# Altium schematic sheet MCU.SchDoc
size A4
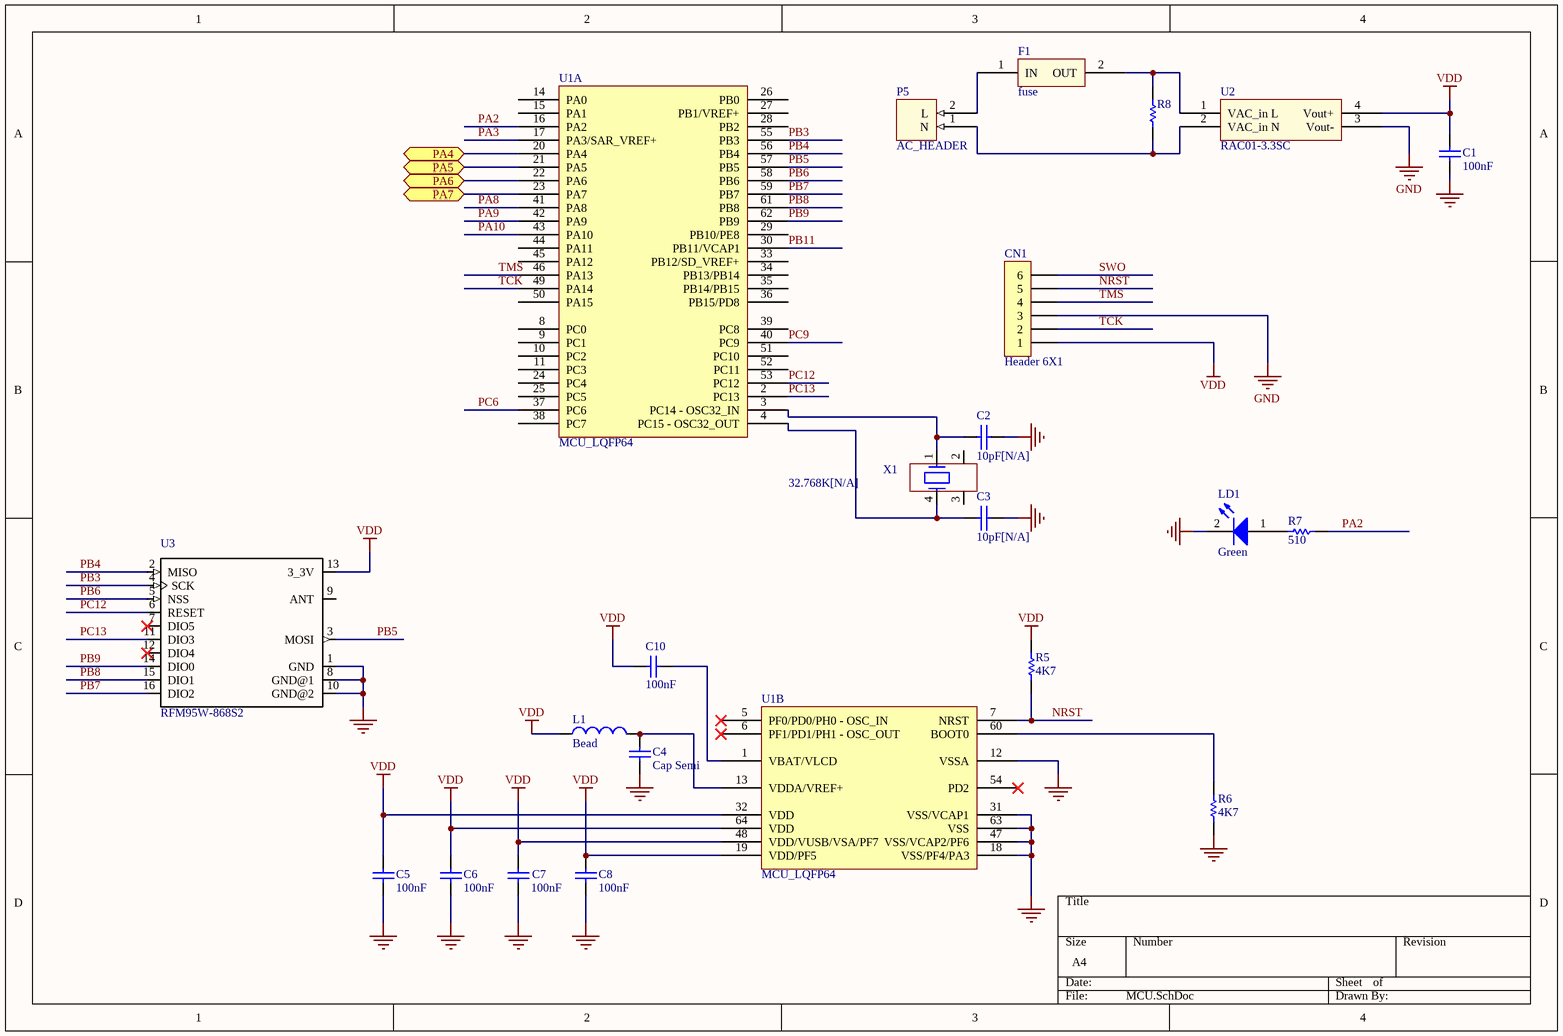
[diagram p0: MCU.SchDoc]

## Parts
C1  100nF  [0603C]
C2  10pF[N/A]  [0603C]
C3  10pF[N/A]  [0603C]
C4  Cap Semi  [1608[0603]]
C5  100nF  [0603C]
C6  100nF  [0603C]
C7  100nF  [0603C]
C8  100nF  [0603C]
C10  100nF  [0603C]
CN1  Header 6X1  [1*6P]
F1  fuse  [fuse]
L1  Bead  [INDC1608L]
LD1  Green  [0603D]
P5  AC_HEADER  [ac_header_2]
R5  4K7  [0603R]
R6  4K7  [0603R]
R7  510  [0603R]
R8  (no value)  [varistor]
U1  MCU_LQFP64  [LQFP64]  (parts A,B of 2)
U2  RAC01-3.3SC  [RAC01-3.3SC]
U3  RFM95W-868S2  [XCVR_RFM95W-868S2]
X1  32.768K[N/A]  [XTAL_4SM_8X3R8]

## Ports
PA4, PA5, PA6, PA7

## Nets
GND: C1.2 C2.2 C3.2 C4.2 C5.2 C6.2 C7.2 C8.2 CN1.3 LD1.2(K) R6.1 U1.12(VSSA) U1.18(VSS/PF4/PA3) U1.31(VSS/VCAP1) U1.47(VSS/VCAP2/PF6) U1.63(VSS) U2.3(Vout-) U3.1(GND) U3.8(GND@1) U3.10(GND@2)
VDD: C1.1 C5.1 C6.1 C7.1 C8.1 C10.1 CN1.1 L1.1 R5.2 U1.19(VDD/PF5) U1.32(VDD) U1.48(VDD/VUSB/VSA/PF7) U1.64(VDD) U2.4(Vout+) U3.13(3_3V)
NRST: CN1.5 R5.1 U1.7(NRST)
PA2: R7.1 U1.16(PA2)
PA3: U1.17(PA3/SAR_VREF+)
PA4: U1.20(PA4) ; port PA4
PA5: U1.21(PA5) ; port PA5
PA6: U1.22(PA6) ; port PA6
PA7: U1.23(PA7) ; port PA7
PA8: U1.41(PA8)
PA9: U1.42(PA9)
PA10: U1.43(PA10)
PB3: U1.55(PB3) U3.4(SCK)
PB4: U1.56(PB4) U3.2(MISO)
PB5: U1.57(PB5) U3.3(MOSI)
PB6: U1.58(PB6) U3.5(NSS)
PB7: U1.59(PB7) U3.16(DIO2)
PB8: U1.61(PB8) U3.15(DIO1)
PB9: U1.62(PB9) U3.14(DIO0)
PB11: U1.30(PB11/VCAP1)
PC6: U1.37(PC6)
PC9: U1.40(PC9)
PC12: U1.53(PC12) U3.6(RESET)
PC13: U1.2(PC13) U3.11(DIO3)
SWO: CN1.6
TCK: CN1.2 U1.49(PA14)
TMS: CN1.4 U1.46(PA13)
NetC2_1: C2.1 U1.3(PC14_-_OSC32_IN) X1.1
NetC3_1: C3.1 U1.4(PC15_-_OSC32_OUT) X1.4
NetC4_1: C4.1 L1.2 U1.13(VDDA/VREF+)
NetC10_2: C10.2 U1.1(VBAT/VLCD)
NetF1_1: F1.1(IN) P5.2(L)
NetF1_2: F1.2(OUT) R8.2 U2.1(VAC_in_L)
NetLD1_1: LD1.1(A) R7.2
NetP5_1: P5.1(N) R8.1 U2.2(VAC_in_N)
NetR6_2: R6.2 U1.60(BOOT0)

Not connected (* = marked no-connect by the designer): U1 5(PF0/PD0/PH0_-_OSC_IN)* 6(PF1/PD1/PH1_-_OSC_OUT)* 8(PC0) 9(PC1) 10(PC2) 11(PC3) 14(PA0) 15(PA1) 24(PC4) 25(PC5) 26(PB0) 27(PB1/VREF+) 28(PB2) 29(PB10/PE8) 33(PB12/SD_VREF+) 34(PB13/PB14) 35(PB14/PB15) 36(PB15/PD8) 38(PC7) 39(PC8) 44(PA11) 45(PA12) 50(PA15) 51(PC10) 52(PC11) 54(PD2)*; U3 7(DIO5)* 9(ANT) 12(DIO4)*; X1 2 3

## Library data of the parts
C1 = Cap: Capacitor; Manufacturer: AVX Corporation; Value: 0.1µF; ProductNumber: C1608X5R1H104K080AA; Vendor Name: Digikey; Vendor PN: 478-6206-1-ND; Published: 8-Jun-2000; Revision: July-2002: Re-released for DXP Platform.; Publisher: Altium Limited; Price: 0.29; Stock: 35
C2 = Cap: Capacitor; Manufacturer: Murata Electronics North America; ProductNumber: GRM1885C1H100JA01D; Value: 10pF; Vendor Name: Digikey; Vendor PN: 490-1403-1-ND; Price: 0,08; Stock: 119.425
C3 = CAP: Capacitor; Manufacturer: Murata Electronics North America; ProductNumber: GRM1885C1H100JA01D; Vendor Name: Digikey
C4 = Cap Semi: Capacitor (Semiconductor SIM Model); Manufacturer: TDK; ProductNumber: C1608X5R1H104K080AA; Vendor Name: Digikey; Published: 8-Jun-2000; LatestRevisionDate: 29-May-2009; LatestRevisionNote: IPC-7351 Footprint Added.; PackageReference: C1206; Publisher: Altium Limited; PackageDescription: Chip Capacitor
C5-C8 = Cap: Capacitor; Manufacturer: TDK; ProductNumber: C1608X5R1H104K080AA; Vendor Name: Digikey; Published: 8-Jun-2000; Revision: July-2002: Re-released for DXP Platform.; Publisher: Altium Limited
C10 = Cap: Capacitor; Manufacturer: AVX Corporation; Value: 0.1µF; ProductNumber: C1608X5R1H104K080AA; Vendor name: Digikey; Vendor PN: 478-6206-1-ND; Published: 8-Jun-2000; Revision: July-2002: Re-released for DXP Platform.; Publisher: Altium Limited; Price: 0.29; Stock: 35
CN1 = Header 6X1: Header, 6-Pin, Single row; Manufacturer: Molex; ProductNumber: 0022232061; Vendor Name: Digikey; Vendor PN: WM4204-ND; LatestRevisionDate: 17-Jul-2002; LatestRevisionNote: Re-released for DXP Platform.; Publisher: Altium Limited; Price: 0.41; Stock: 26,758
F1 = fuse: 240VAC 1A; Manufacturer: Bel Fuse Inc.; ProductNumber: RST 1-BULK; Value: 1A 250VAC; Vendor Name: Digikey; Vendor PN: 507-1176-ND; Price: 0.36; Stock: 11,016
L1 = Inductor: Manufacturer: Taiyo Yuden; Code_IEC: 1005; Value: 600 OHM; ProductNumber: BK1608HS601-T; Vendor Name: Digikey; Vendor PN: 587-1874-1-ND; Published: 8-Jun-2000; LatestRevisionDate: 29-May-2009; LatestRevisionNote: IPC-7351 Footprint Added.; PackageReference: 0402-A; Publisher: Altium Limited; PackageDescription: Chip Inductor; Code_JEITA: 0402; Price: 0.10; Stock: 40,993
LD1 = LED2: Typical RED, GREEN, YELLOW, AMBER GaAs LED; Manufacturer: Lite-On; ProductNumber: LTST-C190KGKT; Value: 571nm; Vendor Name: Digikey; Vendor PN: 160-1435-1-ND; Published: 8-Jun-2000; Revision: July-2002: Re-released for DXP Platform.; Publisher: Altium Limited; Price: 0,27; Stock: 1.780.452
P5 = AC_HEADER: Manufacturer: On Shore Technology; ProductNumber: OSTTC022162; Vendor Name: Digikey; Vendor PN: ED2609-ND; Price: 0,80; Stock: 48.711
R5 = Res1: Resistor; Manufacturer: Yageo; Value: 4.7 kOhms; ProductNumber: RC0603JR-074K7L; Vendor Name: Digikey; Vendor PN: 311-4.7KGRCT-ND; Published: 8-Jun-2000; Publisher: Altium Limited; Revision: July-2002: Re-released for DXP Platform.; Price: 0,10; Stock: 3.704.975
R6 = Res1: Resistor; Manufacturer: Yageo; ProductNumber: RC0603JR-074K7L; Vendor Name: Digikey; Published: 8-Jun-2000; Publisher: Altium Limited; Revision: July-2002: Re-released for DXP Platform.
R7 = Res1: Resistor; Manufacturer: Rohm Semiconductor; Value: 510 Ohms; ProductNumber: ESR03EZPJ511; Vendor Name: Digikey; Vendor PN: RHM510DCT-ND; Published: 8-Jun-2000; Revision: July-2002: Re-released for DXP Platform.; Publisher: Altium Limited; Price: 0.10; Stock: 24,289
R8 = Res1: Resistor; Manufacturer: Epcos (TDK); Value: 360V 400A; ProductNumber: B72205S0231K101; Vendor Name: Digikey; Vendor PN: 495-6478-ND; Published: 8-Jun-2000; Publisher: Altium Limited; Revision: July-2002: Re-released for DXP Platform.; Price: 0.40; Stock: 1,230
U1 = MCU_LQFP64: Manufacturer: STM; ProductNumber: STM32L476RGT6; Vendor Name: Mouser; Vendor PN: 511-STM32L476RGT6; Price: 7,76; Stock: 4.505
U2 = RAC01-3.3SC: AC/DC converter; Manufacturer: Recom Power; Vendor Name: Mouser; Vendor PN: 919-RAC01-3.3SC; ProductNumber: RAC01-3.3SC; Price: 10,63; Stock: 268
U3 = RFM95W-868S2: Manufacturer: RF Solutions; MF: Hope Microelectronics; Vendor Name: Digikey; Vendor PN: RFM95W-868S2-ND; MP: RFM95W-868S2; Availability: Warning; Price: 15,16; Package: SMD-16 Hope Microelectronics; Value: *; ProductNumber: RFM95W-868S2; Stock: 467
X1 = MC306: Vendor Name: Digikey